# Altium schematic sheet modFOC-Powerstage.SchDoc
size A4; SheetNumber: 3; SheetTotal: 3
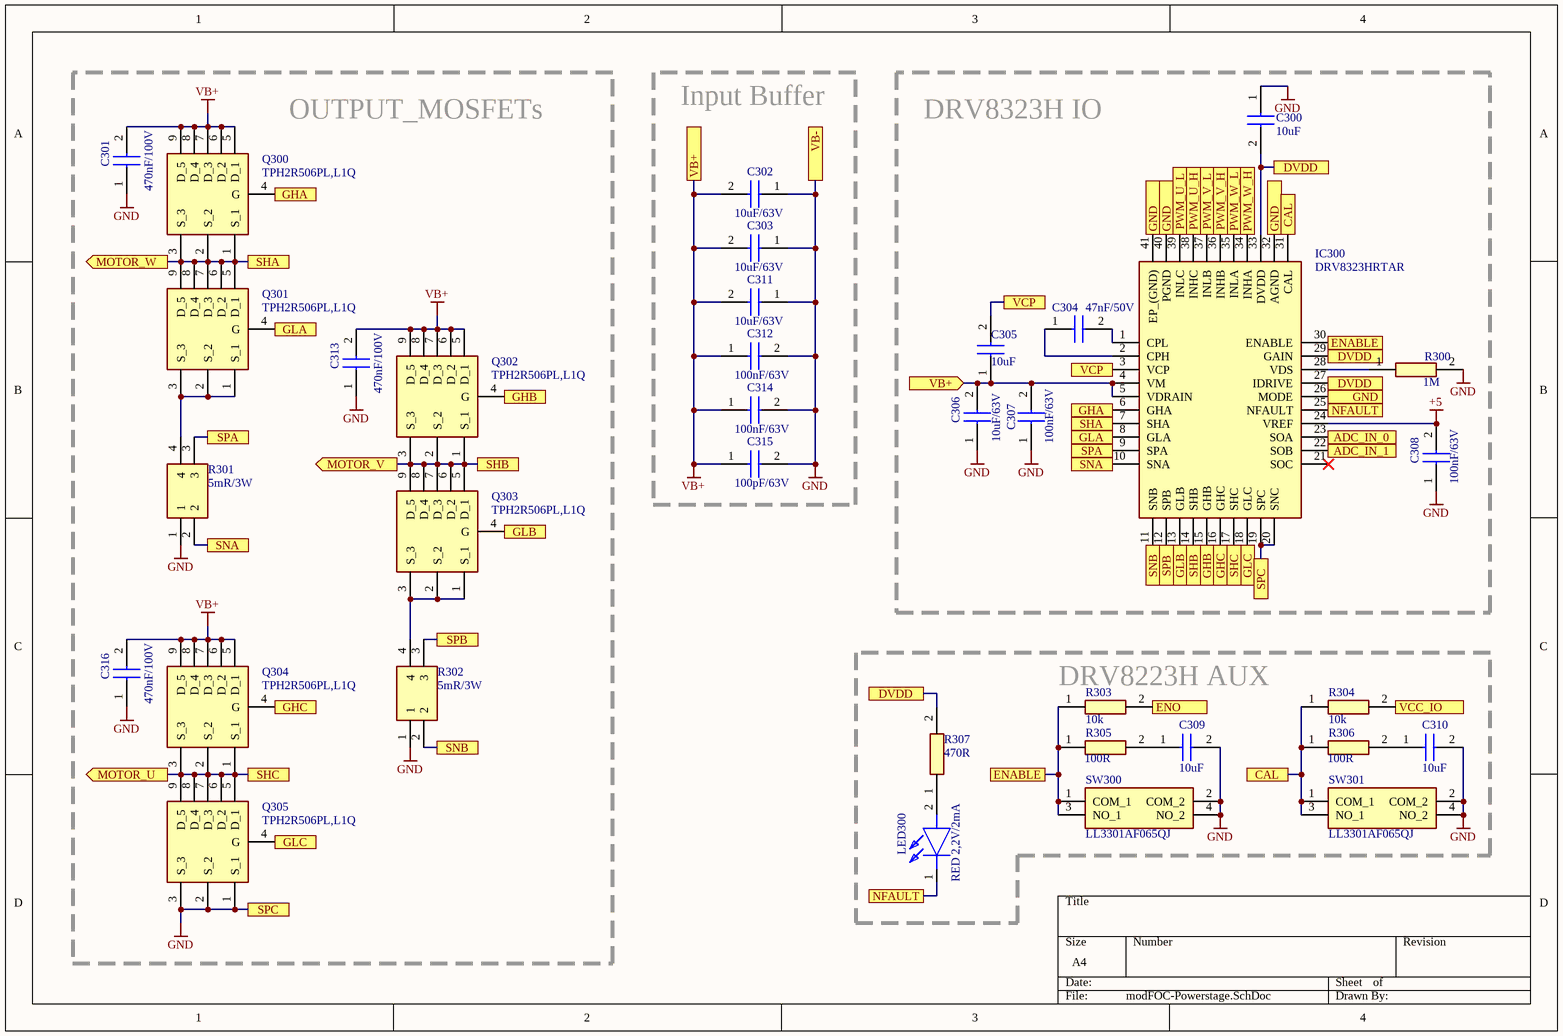
[diagram p0: modFOC-Powerstage.SchDoc]

## Parts
C300  10uF  [CAPC3225X280N]
C301  470nF/100V  [CAPC2012X140N]
C302  10uF/63V  [CAPC3225X280N]
C303  10uF/63V  [CAPC3225X280N]
C304  47nF/50V  [CAPC1608X90N]
C305  10uF  [CAPC3225X280N]
C306  10uF/63V  [CAPC3225X280N]
C307  100nF/63V  [CAPC1608X97N]
C308  100nF/63V  [CAPC1608X97N]
C309  10uF  [CAPC3225X280N]
C310  10uF  [CAPC3225X280N]
C311  10uF/63V  [CAPC3225X280N]
C312  100nF/63V  [CAPC1608X97N]
C313  470nF/100V  [CAPC2012X140N]
C314  100nF/63V  [CAPC1608X97N]
C315  100pF/63V  [CAPC1608X87N]
C316  470nF/100V  [CAPC2012X140N]
IC300  DRV8323HRTAR  [QFN50P600X600X80-41N-D]
LED300  RED 2,2V/2mA  [LSL29KG1J21Z]
Q300  TPH2R506PL,L1Q  [TPHR9003NLL1Q]
Q301  TPH2R506PL,L1Q  [TPHR9003NLL1Q]
Q302  TPH2R506PL,L1Q  [TPHR9003NLL1Q]
Q303  TPH2R506PL,L1Q  [TPHR9003NLL1Q]
Q304  TPH2R506PL,L1Q  [TPHR9003NLL1Q]
Q305  TPH2R506PL,L1Q  [TPHR9003NLL1Q]
R300  1M  [RESC1608X55N]
R301  5mR/3W  [WSK12161L000FEA]
R302  5mR/3W  [WSK12161L000FEA]
R303  10k  [RESC1608X55N]
R304  10k  [RESC1608X55N]
R305  100R  [RESC1608X55N]
R306  100R  [RESC1608X55N]
R307  470R  [RESC1608X55N]
SW300  LL3301AF065QJ  [LL3301FF065QJ]
SW301  LL3301AF065QJ  [LL3301FF065QJ]

## Blocks framed on the sheet
OUTPUT_MOSFETs: C301 C313 C316 Q300-Q305 R301 R302
Input Buffer: C302 C303 C311 C312 C314 C315
DRV8323H IO: C300 C304-C308 IC300 R300
DRV8223H AUX: C309 C310 LED300 R303-R307 SW300 SW301

## Ports
ADC_IN_0, ADC_IN_1, CAL, DVDD, ENABLE, ENO, GHA, GHB, GHC, GLA, GLB, GLC, GND, MOTOR_U (out), MOTOR_V (out), MOTOR_W (out), NFAULT, PWM_U_H, PWM_U_L, PWM_V_H, PWM_V_L, PWM_W_H, PWM_W_L, SHA, SHB, SHC, SNA, SNB, SPA, SPB, SPC, VB+, VB+ (in), VB-, VCC_IO, VCP

## Nets
+5: C308.2 IC300.24(VREF)
GND: C300.1 C301.1 C302.1 C303.1 C306.1 C307.1 C308.1 C309.2 C310.2 C311.1 C312.2 C313.1 C314.2 C315.2 C316.1 IC300.19(SPC) IC300.20(SNC) Q305.1(S_1) Q305.2(S_2) Q305.3(S_3) R300.2 R301.1 R302.1 SW300.2(COM_2) SW300.4(NO_2) SW301.2(COM_2) SW301.4(NO_2) ; port SPC, port VB-
VB+: C301.2 C302.2 C303.2 C305.1 C306.2 C307.2 C311.2 C312.1 C313.2 C314.1 C315.1 C316.2 IC300.4(VM) IC300.5(VDRAIN) Q300.5(D_1) Q300.6(D_2) Q300.7(D_3) Q300.8(D_4) Q300.9(D_5) Q302.5(D_1) Q302.6(D_2) Q302.7(D_3) Q302.8(D_4) Q302.9(D_5) Q304.5(D_1) Q304.6(D_2) Q304.7(D_3) Q304.8(D_4) Q304.9(D_5) ; port VB+
ADC_IN_0: IC300.23(SOA) ; port ADC_IN_0
ADC_IN_1: IC300.22(SOB) ; port ADC_IN_1
CAL: IC300.31(CAL) R304.1 R306.1 SW301.1(COM_1) SW301.3(NO_1) ; port CAL
DVDD: C300.2 IC300.27(IDRIVE) IC300.29(GAIN) IC300.33(DVDD) R307.2 ; port DVDD
ENABLE: IC300.30(ENABLE) R303.1 R305.1 SW300.1(COM_1) SW300.3(NO_1) ; port ENABLE
ENO: R303.2 ; port ENO
GHA: IC300.6(GHA) Q300.4(G) ; port GHA
GHB: IC300.15(GHB) Q302.4(G) ; port GHB
GHC: IC300.16(GHC) Q304.4(G) ; port GHC
GLA: IC300.8(GLA) Q301.4(G) ; port GLA
GLB: IC300.13(GLB) Q303.4(G) ; port GLB
GLC: IC300.18(GLC) Q305.4(G) ; port GLC
GND: IC300.26(MODE) IC300.32(AGND) IC300.40(PGND) IC300.41(EP_(GND)) ; port GND  [a separate net that carries the same name]
MOTOR_U: IC300.17(SHC) Q304.1(S_1) Q304.2(S_2) Q304.3(S_3) Q305.5(D_1) Q305.6(D_2) Q305.7(D_3) Q305.8(D_4) Q305.9(D_5) ; port SHC, port MOTOR_U
MOTOR_V: IC300.14(SHB) Q302.1(S_1) Q302.2(S_2) Q302.3(S_3) Q303.5(D_1) Q303.6(D_2) Q303.7(D_3) Q303.8(D_4) Q303.9(D_5) ; port SHB, port MOTOR_V
MOTOR_W: IC300.7(SHA) Q300.1(S_1) Q300.2(S_2) Q300.3(S_3) Q301.5(D_1) Q301.6(D_2) Q301.7(D_3) Q301.8(D_4) Q301.9(D_5) ; port SHA, port MOTOR_W
NFAULT: IC300.25(NFAULT) LED300.1(K) ; port NFAULT
PWM_U_H: IC300.38(INHC) ; port PWM_U_H
PWM_U_L: IC300.39(INLC) ; port PWM_U_L
PWM_V_H: IC300.36(INHB) ; port PWM_V_H
PWM_V_L: IC300.37(INLB) ; port PWM_V_L
PWM_W_H: IC300.34(INHA) ; port PWM_W_H
PWM_W_L: IC300.35(INLA) ; port PWM_W_L
SNA: IC300.10(SNA) R301.2 ; port SNA
SNB: IC300.11(SNB) R302.2 ; port SNB
SPA: IC300.9(SPA) R301.3 ; port SPA
SPB: IC300.12(SPB) R302.3 ; port SPB
VCC_IO: R304.2 ; port VCC_IO
VCP: C305.2 IC300.3(VCP) ; port VCP
NetC304_1: C304.1 IC300.2(CPH)
NetC304_2: C304.2 IC300.1(CPL)
NetC309_1: C309.1 R305.2
NetC310_1: C310.1 R306.2
NetIC300_28: IC300.28(VDS) R300.1
NetLED300_2: LED300.2(A) R307.1
NetQ301_1: Q301.1(S_1) Q301.2(S_2) Q301.3(S_3) R301.4
NetQ303_1: Q303.1(S_1) Q303.2(S_2) Q303.3(S_3) R302.4

Not connected (* = marked no-connect by the designer): IC300 21(SOC)*

## Library data of the parts
C300 C302 C303 C305 C306 C309-C311 = CL32B106KMVNNWE: Capacitor; Manufacturer_Name: Samsung Electro-Mechanics; Datasheet Link: https://www.arrow.com/en/products/cl32b106kmvnnwe/samsung-electro-mechanics; Height: 2.8mm; Manufacturer_Part_Number: CL32B106KMVNNWE; Arrow Part Number: CL32B106KMVNNWE; Arrow Price/Stock: https://www.arrow.com/en/products/cl32b106kmvnnwe/samsung-electro-mechanics; Mouser Part Number: 187-CL32B106KMVNNWE; Mouser Price/Stock: https://www.mouser.co.uk/ProductDetail/Samsung-Electro-Mechanics/CL32B106KMVNNWE?qs=xZ%2FP%252Ba9zWqaEMBbSgKy8gQ%3D%3D
C301 C313 C316 = 08051C474KAT2A: Capacitor; Manufacturer_Name: AVX; Datasheet Link: http://datasheets.avx.com/X7RDielectric.pdf; Height: 1.4mm; Manufacturer_Part_Number: 08051C474KAT2A; Mouser Part Number: 581-08051C474KAT2A; Mouser Price/Stock: https://www.mouser.co.uk/ProductDetail/AVX/08051C474KAT2A?qs=%2FjdEcI0p95Mz%2FN5KbrGN6Q%3D%3D
C304 = CGA3E2X7R1H473K080AA: Capacitor; Manufacturer_Name: TDK; Datasheet Link: http://docs-emea.rs-online.com/webdocs/14e9/0900766b814e9125.pdf; Height: 0.9mm; Manufacturer_Part_Number: CGA3E2X7R1H473K080AA; Mouser Part Number: 810-CGA3E2X7R1H473K; Mouser Price/Stock: https://www.mouser.co.uk/ProductDetail/TDK/CGA3E2X7R1H473K080AA?qs=NRhsANhppD%252BXNlr9LoLgTw%3D%3D; Arrow Part Number: CGA3E2X7R1H473K080AA; Arrow Price/Stock: https://www.arrow.com/en/products/cga3e2x7r1h473k080aa/tdk
C307 C308 C312 C314 = C0805C104MMREC7210: Capacitor; Manufacturer_Name: Vishay; Manufacturer_Part_Number: VJ0603Y104JXJAC; Datasheet Link: http://www.vishay.com/docs/45226/vj31xrohsautomlcc.pdf; Height: 1mm; Mouser Part Number: 77-VJ0603Y104JXJAC; Mouser Price/Stock: https://www.mouser.com/Search/Refine.aspx?Keyword=77-VJ0603Y104JXJAC
C315 = C0603C101K1HACTU: Capacitor; Manufacturer_Name: Kemet; Datasheet Link: https://www.mouser.com/datasheet/2/212/KEM_C1007_X8R_ULTRA_150C_SMD-1102703.pdf; Height: 0.87mm; Manufacturer_Part_Number: C0603C101K1HACTU; Mouser Part Number: 80-C0603C101K1HACTU; Mouser Price/Stock: https://www.mouser.co.uk/ProductDetail/KEMET/C0603C101K1HACTU?qs=W0yvOO0ixfE5G01qpfeqIQ%3D%3D
IC300 = DRV8323HRTAR: Integrated Circuit; Manufacturer_Name: Texas Instruments; Datasheet Link: http://www.ti.com/lit/gpn/drv8323; Height: 0.8mm; Manufacturer_Part_Number: DRV8323HRTAR; Mouser Part Number: 595-DRV8323HRTAR; Mouser Price/Stock: https://www.mouser.co.uk/ProductDetail/Texas-Instruments/DRV8323HRTAR?qs=u4fy%2FsgLU9N%252BsI8bz2iwaQ%3D%3D; Arrow Part Number: DRV8323HRTAR; Arrow Price/Stock: https://www.arrow.com/en/products/drv8323hrtar/texas-instruments
LED300 = LS_L29K-G1J2-1-Z: LED; Manufacturer_Name: OSRAM; Manufacturer_Part_Number: LS L29K-G1J2-1-Z; Datasheet Link: https://dammedia.osram.info/media/resource/hires/osram-dam-5662679/LS%20L29K_EN.pdf; Height: 0.67mm; Mouser Part Number: 720-LSL29K-G1J2-1-Z; Mouser Price/Stock: https://www.mouser.co.uk/ProductDetail/OSRAM-Opto-Semiconductors/LS-L29K-G1J2-1-Z?qs=nTDll3UaDK6mUW9LNPY0Mw%3D%3D
Q300-Q305 = TPH2R506PL,L1Q: MOSFET (N-Channel); Manufacturer_Name: Toshiba; Datasheet Link: http://toshiba.semicon-storage.com/info/docget.jsp?did=55522&prodName=TPH2R506PL; Height: 1mm; Manufacturer_Part_Number: TPH2R506PL,L1Q; Mouser Part Number: 757-TPH2R506PLL1Q; Mouser Price/Stock: https://www.mouser.co.uk/ProductDetail/Toshiba/TPH2R506PLL1Q?qs=bUPhaerQQeFGJjj6SxbPEQ%3D%3D; Arrow Part Number: TPH2R506PL,L1Q; Arrow Price/Stock: https://www.arrow.com/en/products/tph2r506pll1q/toshiba
R300 = RC0603FR-071ML: Resistor; Manufacturer_Name: YAGEO (PHYCOMP); Datasheet Link: https://www.yageo.com/upload/media/product/productsearch/datasheet/rchip/PYu-RC_Group_51_RoHS_L_11.pdf; Height: 0.55mm; Manufacturer_Part_Number: RC0603FR-071ML; Mouser Part Number: 603-RC0603FR-071ML; Mouser Price/Stock: https://www.mouser.co.uk/ProductDetail/Yageo/RC0603FR-071ML/?qs=VU8sRB4EgwDPceeQKB324w%3D%3D; Arrow Part Number: RC0603FR-071ML; Arrow Price/Stock: https://www.arrow.com/en/products/rc0603fr-071ml/yageo
R301 R302 = WSK1216L5000FEA: Resistor; Manufacturer_Name: Vishay; Datasheet Link: http://www.vishay.com/docs/30189/wsk1216.pdf; Height: 1.9mm; Manufacturer_Part_Number: WSK1216L5000FEA
R303 R304 = RC0603FR-0710KL: Resistor; Manufacturer_Name: YAGEO (PHYCOMP); Datasheet Link: http://www.yageo.com/documents/recent/PYu-RC0603_51_RoHS_L_v5.pdf; Height: 0.55mm; Manufacturer_Part_Number: RC0603FR-0710KL; Arrow Part Number: RC0603FR-0710KL; Arrow Price/Stock: https://www.arrow.com/en/products/rc0603fr-0710kl/yageo; Mouser Part Number: 603-RC0603FR-0710KL; Mouser Price/Stock: https://www.mouser.co.uk/ProductDetail/Yageo/RC0603FR-0710KL?qs=grNVn54RoB%252B3GtjbJj3wJQ%3D%3D
R305 R306 = CRCW0603100RFKEAC: Resistor; Manufacturer_Name: Vishay; Datasheet Link: https://componentsearchengine.com/Datasheets/1/CRCW0603100RFKEAC.pdf; Height: 0.55mm; Manufacturer_Part_Number: CRCW0603100RFKEAC; Mouser Part Number: 71-CRCW0603100RFKEAC; Mouser Price/Stock: https://www.mouser.co.uk/ProductDetail/Vishay-Dale/CRCW0603100RFKEAC/?qs=E3Y5ESvWgWPJqb4%2F19sAKw%3D%3D; Arrow Part Number: CRCW0603100RFKEAC; Arrow Price/Stock: https://www.arrow.com/en/products/crcw0603100rfkeac/vishay
R307 = RC0603FR-10470RL: Resistor; Manufacturer_Name: YAGEO (PHYCOMP); Datasheet Link: http://www.yageo.com/documents/recent/PYu-RC0603_51_RoHS_L_v5.pdf; Height: 0.55mm; Manufacturer_Part_Number: RC0603FR-10470RL; Mouser Part Number: 603-RC0603FR-10470RL; Mouser Price/Stock: https://www.mouser.co.uk/ProductDetail/Yageo/RC0603FR-10470RL?qs=EiqXWrxQq62gi8HBTlzDog%3D%3D
SW300 SW301 = LL3301AF065QJ: Switch; Manufacturer_Name: E-Switch; Datasheet Link: https://media.digikey.com/pdf/Data%20Sheets/E-Switch%20PDFs/LL3301AF065QJ.pdf; Height: 7.3mm; Manufacturer_Part_Number: LL3301AF065QJ; Mouser Part Number: 612-LL3301AF065QJ; Mouser Price/Stock: https://www.mouser.co.uk/ProductDetail/E-Switch/LL3301AF065QJ?qs=QtyuwXswaQi68RkbBY57jQ%3D%3D